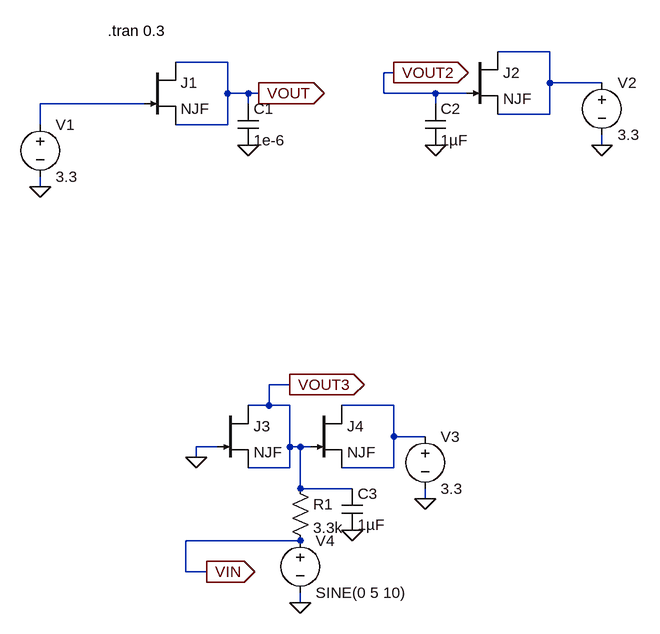
[diagram p0: schematic jfet_diode.asc]
jfet_diode.asc, the LTspice schematic file:
Version 4.1
SHEET 1 988 744
WIRE 688 -128 608 -128
WIRE 192 -112 112 -112
WIRE 448 -96 432 -96
WIRE 688 -80 688 -128
WIRE 768 -80 688 -80
WIRE 192 -64 192 -112
WIRE 224 -64 192 -64
WIRE 240 -64 224 -64
WIRE 432 -64 432 -96
WIRE 512 -64 432 -64
WIRE 560 -64 512 -64
WIRE 64 -48 -96 -48
WIRE 224 -48 224 -64
WIRE 512 -48 512 -64
WIRE 688 -32 688 -80
WIRE 688 -32 608 -32
WIRE -96 -16 -96 -48
WIRE 192 -16 192 -64
WIRE 192 -16 112 -16
WIRE 768 16 768 0
WIRE -96 80 -96 64
WIRE 288 384 256 384
WIRE 256 416 256 384
WIRE 256 416 224 416
WIRE 288 416 256 416
WIRE 448 416 368 416
WIRE 448 464 448 416
WIRE 496 464 448 464
WIRE 176 480 144 480
WIRE 288 480 288 416
WIRE 304 480 288 480
WIRE 320 480 304 480
WIRE 144 496 144 480
WIRE 288 512 288 480
WIRE 288 512 224 512
WIRE 448 512 448 464
WIRE 448 512 368 512
WIRE 304 544 304 480
WIRE 384 544 304 544
WIRE 496 560 496 544
WIRE 304 624 128 624
WIRE 128 672 128 624
WIRE 160 672 128 672
WIRE 304 720 304 704
FLAG -96 80 0
FLAG 240 -64 VOUT
IOPIN 240 -64 Out
FLAG 224 16 0
FLAG 768 16 0
FLAG 448 -96 VOUT2
IOPIN 448 -96 Out
FLAG 512 16 0
FLAG 288 384 VOUT3
IOPIN 288 384 Out
FLAG 144 496 0
FLAG 496 560 0
FLAG 304 720 0
FLAG 384 608 0
FLAG 160 672 VIN
IOPIN 160 672 Out
SYMBOL njf 64 -112 R0
SYMATTR InstName J1
SYMBOL cap 208 -48 R0
SYMATTR InstName C1
SYMATTR Value 1e-6
SYMBOL voltage -96 -32 R0
WINDOW 123 0 0 Left 0
WINDOW 39 0 0 Left 0
SYMATTR InstName V1
SYMATTR Value 3.3
SYMBOL njf 560 -128 R0
SYMATTR InstName J2
SYMBOL cap 496 -48 R0
SYMATTR InstName C2
SYMATTR Value 1µF
SYMBOL voltage 768 -96 R0
WINDOW 123 0 0 Left 0
WINDOW 39 0 0 Left 0
SYMATTR InstName V2
SYMATTR Value 3.3
SYMBOL njf 176 416 R0
SYMATTR InstName J3
SYMBOL njf 320 416 R0
SYMATTR InstName J4
SYMBOL voltage 496 448 R0
WINDOW 123 0 0 Left 0
WINDOW 39 0 0 Left 0
SYMATTR InstName V3
SYMATTR Value 3.3
SYMBOL voltage 304 608 R0
WINDOW 123 0 0 Left 0
WINDOW 39 0 0 Left 0
SYMATTR InstName V4
SYMATTR Value SINE(0 5 10)
SYMBOL res 288 528 R0
SYMATTR InstName R1
SYMATTR Value 3.3k
SYMBOL cap 368 544 R0
SYMATTR InstName C3
SYMATTR Value 1µF
TEXT 8 -160 Left 2 !.tran 0.3

The netlist it stands for:
* jfet_diode.asc
J1 VOUT N002 VOUT NJF
C1 VOUT 0 1e-6
V1 N002 0 3.3
J2 N001 VOUT2 N001 NJF
C2 VOUT2 0 1µF
V2 N001 0 3.3
J3 VOUT3 0 VOUT3 NJF
J4 N003 VOUT3 N003 NJF
V3 N003 0 3.3
V4 VIN 0 SINE(0 5 10)
R1 VOUT3 VIN 3.3k
C3 VOUT3 0 1µF
.model NJF NJF
.model PJF PJF
.lib standard.jft
.tran 0.3
.backanno
.end